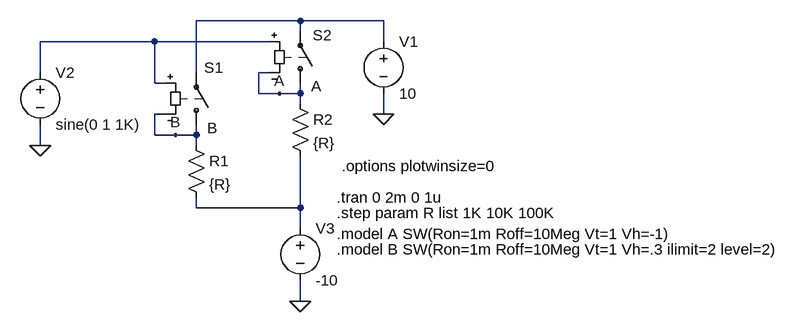
[diagram p0: schematic EmitFollow.asc]
EmitFollow.asc, the LTspice schematic file:
Version 4
SHEET 1 1276 680
WIRE 112 -256 -48 -256
WIRE 240 -256 112 -256
WIRE 112 -240 112 -256
WIRE -112 -224 -288 -224
WIRE 64 -224 -112 -224
WIRE 240 -224 240 -256
WIRE -288 -176 -288 -224
WIRE -48 -176 -48 -256
WIRE 64 -176 48 -176
WIRE -112 -160 -112 -224
WIRE -96 -160 -112 -160
WIRE 48 -144 48 -176
WIRE 80 -144 48 -144
WIRE 112 -144 112 -160
WIRE 112 -144 80 -144
WIRE 112 -128 112 -144
WIRE -96 -112 -112 -112
WIRE 240 -112 240 -144
WIRE -112 -80 -112 -112
WIRE -80 -80 -112 -80
WIRE -48 -80 -48 -96
WIRE -48 -80 -80 -80
WIRE -288 -64 -288 -96
WIRE -48 -64 -48 -80
WIRE -48 32 -48 16
WIRE 112 32 112 -48
WIRE 112 32 -48 32
WIRE 112 64 112 32
WIRE 112 176 112 144
FLAG -288 -64 0
FLAG 240 -112 0
FLAG 112 176 0
FLAG 80 -144 A
FLAG -80 -80 B
SYMBOL sw -48 -80 M180
WINDOW 0 12 104 Left 2
WINDOW 3 17 11 Left 2
SYMATTR InstName S1
SYMATTR Value B
SYMBOL res -64 -80 R0
SYMATTR InstName R1
SYMATTR Value {R}
SYMBOL voltage 240 -240 R0
SYMATTR Value 10
SYMATTR InstName V1
SYMBOL sw 112 -144 M180
WINDOW 0 19 90 Left 2
WINDOW 3 17 11 Left 2
SYMATTR InstName S2
SYMATTR Value A
SYMBOL voltage -288 -192 R0
SYMATTR InstName V2
SYMATTR Value sine(0 1 1K)
SYMBOL res 96 -144 R0
SYMATTR InstName R2
SYMATTR Value {R}
SYMBOL voltage 112 48 R0
SYMATTR Value -10
SYMATTR InstName V3
TEXT 168 96 Left 2 !.model B SW(Ron=1m Roff=10Meg Vt=1 Vh=.3 ilimit=2 level=2)
TEXT 168 16 Left 2 !.tran 0 2m 0 1u
TEXT 168 72 Left 2 !.model A SW(Ron=1m Roff=10Meg Vt=1 Vh=-1)
TEXT 168 40 Left 2 !.step param R list 1K 10K 100K
TEXT 176 -32 Left 2 !.options plotwinsize=0

The netlist it stands for:
* EmitFollow.asc
S1 B N001 N002 B B
R1 B N003 {R}
V1 N001 0 10
S2 A N001 N002 A A
V2 N002 0 sine(0 1 1K)
R2 A N003 {R}
V3 N003 0 -10
.model B SW(Ron=1m Roff=10Meg Vt=1 Vh=.3 ilimit=2 level=2)
.tran 0 2m 0 1u
.model A SW(Ron=1m Roff=10Meg Vt=1 Vh=-1)
.step param R list 1K 10K 100K
.options plotwinsize=0
.backanno
.end